# Altium schematic sheet Sheet1.SchDoc: Evaluation bord NanEyeC and Back scatter
size A; Author: Simen Ødegård; SheetNumber: 1; SheetTotal: 3